# EAGLE design USB-A (EAGLE 9.3.2)
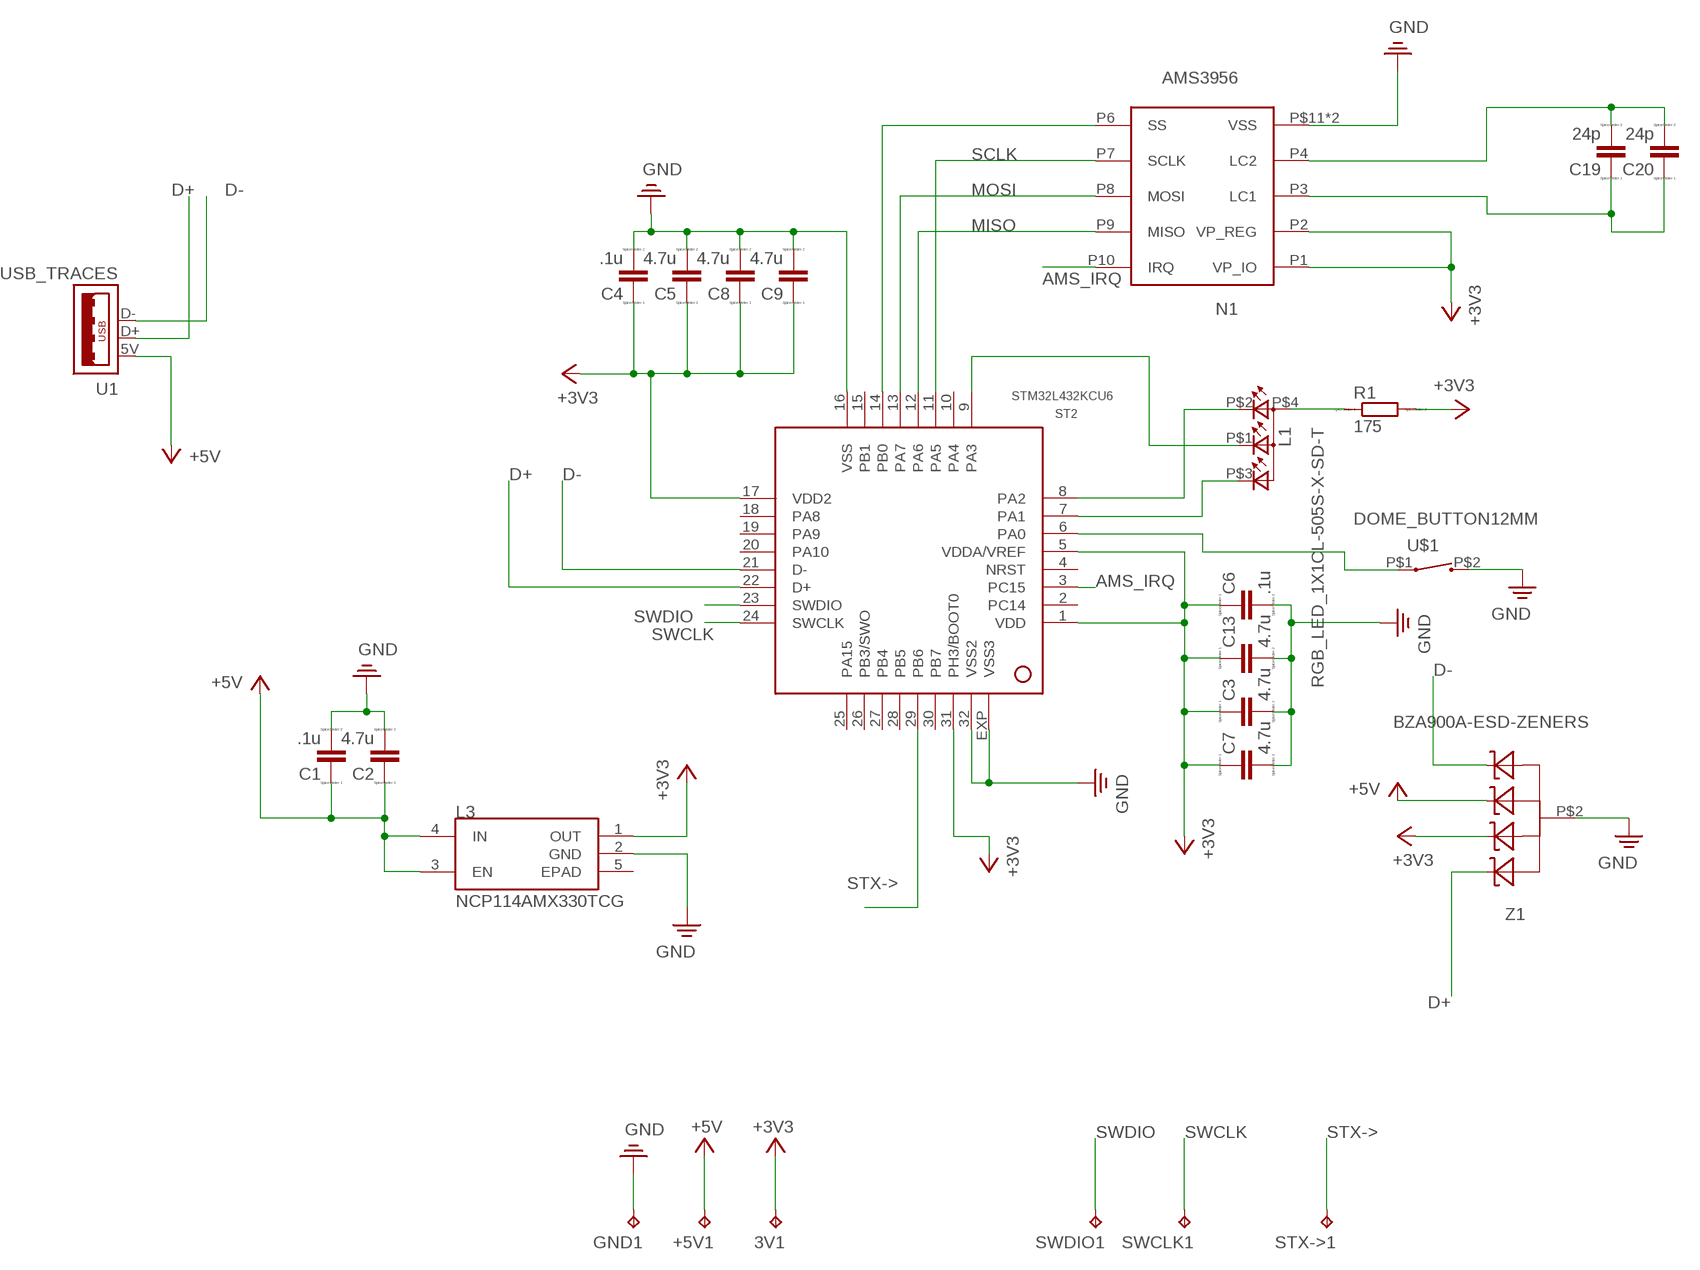
[diagram p0: schematic, sheet 1]

## Parts
3V1  TEST_POINT  [B1,27]
+5V1  TEST_POINT  [B1,27]
C1  .1u  CAPACITOR  [C0402]
C2  4.7u  CAPACITOR  [C0402]
C3  4.7u  CAPACITOR  [C0402]
C4  .1u  CAPACITOR  [C0402]
C5  4.7u  CAPACITOR  [C0402]
C6  .1u  CAPACITOR  [C0402]
C7  4.7u  CAPACITOR  [C0402]
C8  4.7u  CAPACITOR  [C0402]
C9  4.7u  CAPACITOR  [C0402]
C13  4.7u  CAPACITOR  [C0402]
C19  24p  CAPACITOR  [C0402]
C20  24p  CAPACITOR  [C0402]
GND1  TEST_POINT  [B1,27]
L1  RGB_LED_1X1CL-505S-X-SD-T  [CL-505S-X-SD-T]
L3  NCP114AMX330TCG  [REG_NCP114AMX330TCG]
N1  AMS3956  [MLPD3X3]
R1  175  RESISTOR  [R0402]
ST2  STM32L432KCU6  [QFN32]
STX->1  TEST_POINT  [B1,27]
SWCLK1  TEST_POINT  [B1,27]
SWDIO1  TEST_POINT  [B1,27]
U1  USB_TRACES  [USB_TRACES]
U$1  DOME_BUTTON12MM  [DOME-BL-12MM]
Z1  BZA900A-ESD-ZENERS  [BZA900A]

## Nets
+3V3: 3V1.TP C3.1 C4.1 C5.1 C6.1 C7.1 C8.1 C9.1 C13.1 L3.1(OUT) N1.P1(VP_IO) N1.P2(VP_REG) R1.2 ST2.1(VDD) ST2.5(VDDA/VREF) ST2.17(VDD2) ST2.31(PH3/BOOT0) Z1.P$5(C1)
+5V: +5V1.TP C1.1 C2.1 L3.3(EN) L3.4(IN) U1.5V Z1.P$1(C)
AMS_CS2: N1.P6(SS) ST2.14(PB0)
AMS_IRQ: N1.P10(IRQ) ST2.3(PC15)
D+: ST2.22(D+) U1.D+ Z1.P$3(C3)
D-: ST2.21(D-) U1.D- Z1.P$4(C2)
MISO: N1.P9(MISO) ST2.12(PA6)
MOSI: N1.P8(MOSI) ST2.13(PA7)
N$1: L1.P$4(A2) R1.1
N$10: L1.P$2(CRED) ST2.8(PA2)
N$13: L1.P$1(CBLUE) ST2.9(PA3)
N$14: L1.P$3(CGREEN) ST2.7(PA1)
N$15: ST2.6(PA0) U$1.P$1
N$16: C19.2 C20.2 N1.P4(LC2)
N$17: C19.1 C20.1 N1.P3(LC1)
PE: C1.2 C2.2 C3.2 C4.2 C5.2 C6.2 C7.2 C8.2 C9.2 C13.2 GND1.TP L3.2(GND) N1.P5(VSS) N1.P$11(VSS) ST2.16(VSS) ST2.32(VSS2) ST2.EXP(VSS3) U$1.P$2 Z1.P$2 ; supply symbol labelled GND
SCLK: N1.P7(SCLK) ST2.11(PA5)
STX->: ST2.29(PB6) STX->1.TP
SWCLK: ST2.24(SWCLK) SWCLK1.TP
SWDIO: ST2.23(SWDIO) SWDIO1.TP
Unconnected: L3.5(EPAD) ST2.2(PC14) ST2.4(NRST) ST2.10(PA4) ST2.15(PB1) ST2.18(PA8) ST2.19(PA9) ST2.20(PA10) ST2.25(PA15) ST2.26(PB3/SWO) ST2.27(PB4) ST2.28(PB5) ST2.30(PB7)

## Library data of the parts
3V1 +5V1 GND1 STX->1 SWCLK1 SWDIO1 = efm-fido:TEST_POINT
C1-C9 C13 C19 C20 = efm-fido:CAPACITOR
L1 = efm-fido:RGB_LED_1X1: EAST1616RGBA3
L3 = efm-fido:NCP114AMX330TCG: CMOS Low Dropout Regulator, 300 mA 3.3V, Active Discharge; AVAILABILITY: Unavailable; DESCRIPTION: CMOS Low Dropout Regulator _LDO_, 300 mA 3.3V, Active Discharge; MF: ON Semiconductor; MP: NCP114AMX330TCG; PACKAGE: UDFN-4 ON Semiconductor; PRICE: None
N1 = efm-fido:AMS3956
R1 = efm-fido:RESISTOR
ST2 = efm-fido:STM32L432KCU6
U1 = efm-fido:USB_TRACES
U$1 = efm-fido:DOME_BUTTON
Z1 = efm-fido:BZA900A-ESD-ZENERS

## Net classes
0 default: width 0.152 mm, drill 0.203 mm, clearance 0.102 mm
1 nfc: width 0.089 mm, drill 0.203 mm, clearance 0.089 mm

## Board
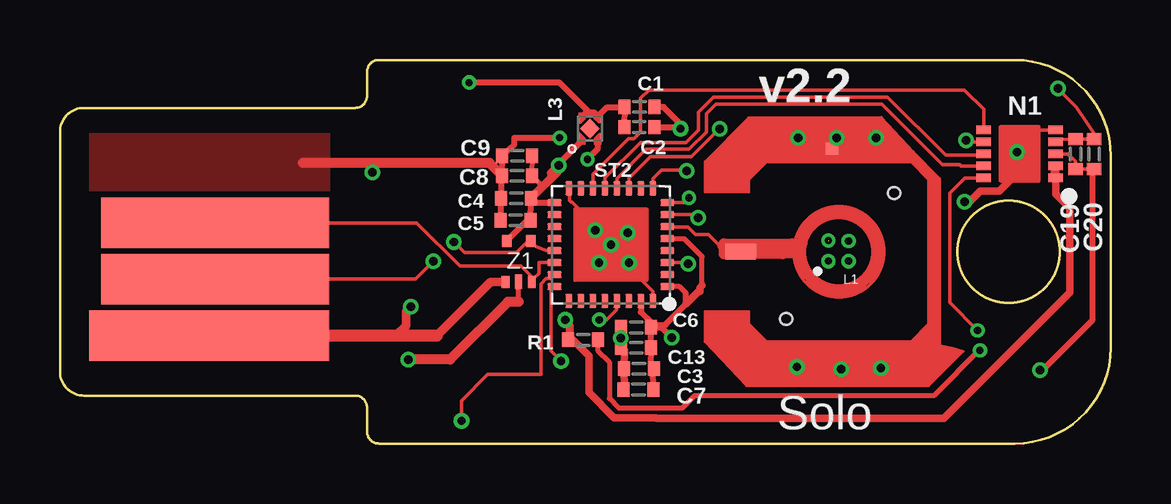
[diagram p1: board, top side]
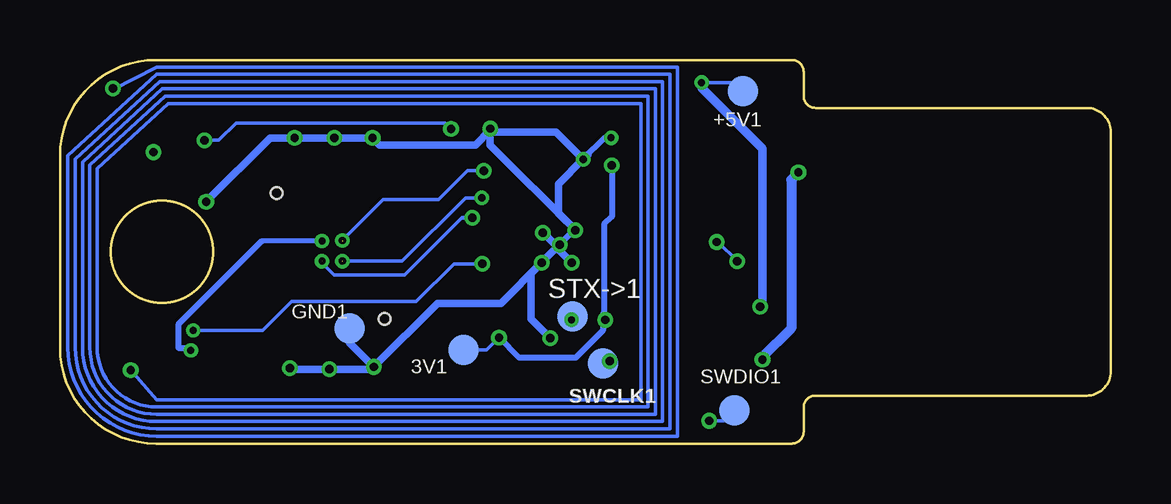
[diagram p2: board, bottom side, seen from below]

Size 43.8 x 16 mm. Coordinates in mm from the lower left corner, seen from the top.
Outline: 0,3 0,13 arc-90 1,14 12.3,14 arc90 12.8,14.5 12.8,15.5 arc-90 13.3,16 39.8,16 arc-90 43.8,12 43.8,4 arc-90 39.8,0 13.3,0 arc-90 12.8,0.5 12.8,1.5 arc90 12.3,2 1,2 arc-90 0,3
Outline: circle at 39.55,8 radius 2.12
Copper layers (1*16): Top 0.035mm / dielectric 2.35mm / Bottom 0.035mm
Design rules "default *": minimum track width 4mil, minimum drill 0.2mm, track to track 4mil, track to pad 4mil, pad to pad 4mil, via to via 5mil, smd to smd 4mil, copper to edge 8mil, drill to drill 6mil, minimum pad ring 10mil, minimum via ring 0.15mm, stop-mask expansion 4mil, vias tented up to drill 0mil, thermal gap 10mil
Holes 0.5 mm at 34.77,10.45 30.27,5.2
tRestrict: area 1.1,10.1 to 1.9,10.3

### Footprints (pad centres in the part's own frame; a part is rotated, then mirrored left to right if it is on the bottom)
B1,27 = smd 1.27 x 1.27: TP 0,0
C0402 = smd 0.5 x 0.6: 1 -0.625,0; 2 0.625,0
CL-505S-X-SD-T = smd 0.4 x 0.4: P$1 0.85,0; P$2 0.85,0.85; P$3 0,0.85; P$4 0,0
REG_NCP114AMX330TCG = smd 0.1 x 0.1: 1 -0.325,-0.5; 2 0.325,-0.5; 3 0.325,0.5; 4 -0.325,0.5 | smd 0.58 x 0.58 rotated 45: 5 0,0
MLPD3X3 = smd 0.6 x 0.35: P1 0,-0.54; P2 0,-1.04; P3 0,-1.54; P4 0,-2.04; P5 0,-2.54; P6 3,-2.54; P7 3,-2.04; P8 3,-1.54; P9 3,-1.04; P10 3,-0.54 | smd 0.2 x 0.2: P$11 1.6,-1.64
R0402 = smd 0.5 x 0.6: 1 -0.625,0; 2 0.625,0
QFN32 = smd 0.6 x 0.3: 1 -2.35,1.75; 2 -2.35,1.25; 3 -2.35,0.75; 4 -2.35,0.25; 5 -2.35,-0.25; 6 -2.35,-0.75; 7 -2.35,-1.25; 8 -2.35,-1.75; 17 2.35,-1.75; 18 2.35,-1.25; 19 2.35,-0.75; 20 2.35,-0.25; 21 2.35,0.25; 22 2.35,0.75; 23 2.35,1.25; 24 2.35,1.75 | smd 0.3 x 0.6: 9 -1.75,-2.35; 10 -1.25,-2.35; 11 -0.75,-2.35; 12 -0.25,-2.35; 13 0.25,-2.35; 14 0.75,-2.35; 15 1.25,-2.35; 16 1.75,-2.35; 25 1.75,2.35; 26 1.25,2.35; 27 0.75,2.35; 28 0.25,2.35; 29 -0.25,2.35; 30 -0.75,2.35; 31 -1.25,2.35; 32 -1.75,2.35 | smd 0.2 x 0.2: EXP 0,0
USB_TRACES = smd 10 x 2.1: 5V 0.9,3.55 | smd 9.5 x 2.1: D+ 0.65,-1.15; D- 0.65,1.2
DOME-BL-12MM = smd 1.27 x 0.635: P$1 -4.1,0 | smd 0.5 x 0.5: P$2 -0.3,4.3
BZA900A = smd 0.325 x 0.5: P$1 -0.05,0; P$3 1.05,0 | smd 0.3 x 0.6: P$2 0.5,0 | smd 0.4 x 0.5: P$4 1,1.7; P$5 0,1.7

### Placement (x,y rotation side)
3V1  26.98,3.9 0 bottom
+5V1  15.34,14.71 0 bottom
C1  24.16,14.04 0 top
C2  24.15,13.2 0 top
C3  24.14,3.13 180 top
C4  19.02,10.23 180 top
C5  19,9.31 180 top
C6  24.02,4.85 180 top
C7  24.12,2.26 180 top
C8  19.05,11.17 180 top
C9  19.06,12 180 top
C13  24.02,4 180 top
C19  .5p  [C0402]  42.34,12.08 90 top
C20  .5p  [C0402]  43.11,12.08 90 top
GND1  31.72,4.8 0 bottom
L1  32.88,8.46 180 top
L3  22.09,13.14 0 top
N1  41.5,10.54 180 top
R1  21.81,4.33 180 top
ST2  22.97,8.3 180 top
STX->1  22.43,5.31 0 bottom
SWCLK1  21.17,3.35 0 bottom
SWDIO1  15.68,1.39 0 bottom
U1  7.12,8.06 180 top
U$1  32.47,8 0 top
Z1  18.62,6.75 0 top

### Tracks (layer width: path | path; a pad name or v marks a point on that pad's centre or on a via)
+3V3  (via drill 0.35)
  Top 0.152: ST2.31 24.15,5.93 | 24.67,5.02 24.76,4.94 | C6.1 24.67,4.85 24.77,4.95 | N1.P2 41.48,11.58 41.46,11.6
  Top 0.2: C9.1 19.66,11.18 C8.1 20.07,10.75
  Top 0.203: 25.27,4.95 25.22,4.95 | 26.09,6.27 25.82,6.55 ST2.1 | ST2.5 26.02,8.55 26.77,7.8 26.77,6.6
  Top 0.254: 21.06,4.23 R1.2 21.21,4.84 21.27,4.9 21.27,4.96 v21.07,5.16 | C5.1 19.64,10.12 C4.1 | C4.1 19.86,10.05 ST2.17 | C4.1 19.7,10.23 | C4.1 19.7,10.23 20.8,11.33 v20.8,11.6 | 19.62,9.22 C5.1 | C4.1 19.62,10.3 20.07,10.75 20.42,11.1 20.42,11.29 L3.1 | 26.09,6.27 26.09,5.82 25.22,4.95 24.77,4.95 | 24.76,4.94 24.72,4.9 C6.1 | C6.1 25.07,4.85 v25.5,4.42 | C6.1 C13.1 24.62,3.25 C3.1 24.72,3.11 C7.1 | Z1.P$5 19.48,9.31 C5.1 | ST2.31 24.22,5.48 24.67,5.02
  Top 0.305: 26.09,5.82 26.62,6.35 26.67,6.35 26.67,6.5 26.77,6.6 | 21.27,4.9 21.27,4.44 22.05,3.66 22.05,2.13 23.1,1.08 24.85,1.08 24.87,1.06 36.85,1.06 42.09,6.3 42.09,9.83 41.5,10.41 N1.P1 N1.P2 | 41.46,11.6 41.46,11.12
  Bottom 0.152: v25.5,4.42 26.02,3.9 27.18,3.9
  Bottom 0.25: 22.3,3.58 24.66,3.58 v25.5,4.42
  Bottom 0.254: 22.3,3.58 21.17,4.72 21.17,5.16 v21.07,5.16 | 27.18,3.9 3V1.TP | v20.8,11.6 20.8,9.47 21.12,9.15 21.12,5.41
  Bottom 0.305: v21.07,5.16 21.12,5.41
+5V  (via drill 0.3, 0.35)
  Top 0.203: 23.5,14.03 C1.1
  Top 0.25: L3.4 21.96,13.84 21.96,13.91 | 22.06,13.82 22.26,13.82 22.41,13.66 L3.3 22.8,14.03 23.5,14.03 | C2.1 C1.1 | 17.69,15.06 v17.06,15.06
  Top 0.254: 22.01,13.87 21.94,13.81 | 22.06,13.82 22.01,13.87 | 22.01,13.87 21.96,13.91 20.82,15.06 17.69,15.06
  Top 0.35: 15.72,4.51 17.96,6.75 Z1.P$1 | 14.02,4.51 14.42,4.91 14.42,5.51 v14.62,5.71
  Top 0.508: U1.5V 14.02,4.51 15.72,4.51
  Bottom 0.152: 15.89,14.71 +5V1.TP 15.69,15.06 v17.06,15.06
  Bottom 0.35: v14.62,5.71 14.52,5.81 14.52,12.31 17.06,14.85 v17.06,15.06
AMS_CS2
  Top 0.152: ST2.14 22.22,11.25 23.69,12.72 23.92,12.72 24.2,13 24.2,14.4 24.55,14.75 37.71,14.75 38.5,13.95 N1.P6
AMS_IRQ  (via drill 0.3, 0.35)
  Top 0.152: v38.25,4.72 37.09,5.88 37.09,10.45 37.72,11.08 N1.P10 | v26.19,7.5 26.14,7.55 ST2.3
  Bottom 0.152: v38.25,4.72 35.35,4.72 34.14,5.93 28.95,5.93 27.38,7.5 v26.19,7.5
D+
  Top 0.152: U1.D+ 14.87,9.21 16.67,7.41 19.22,7.41 19.75,6.88 | 19.75,6.88 19.67,6.8 Z1.P$3 19.7,6.74 | 19.75,6.88 19.97,7.1 19.97,7.55 ST2.22
D-  (via drill 0.35)
  Top 0.152: U1.D- 14.82,6.86 v15.57,7.61 | ST2.21 20.26,8.05 19.84,8.22 Z1.P$4 19.52,8.45 19.03,7.96 16.86,7.96 v16.42,8.41
  Bottom 0.152: v16.42,8.41 16.37,8.41 v15.57,7.61
MISO
  Top 0.152: ST2.12 23.22,11.06 24.43,12.28 26.23,12.28 26.94,12.99 26.94,13.76 27.33,14.15 34.26,14.15 36.79,11.63 37.5,11.63 37.55,11.58 N1.P9
MOSI
  Top 0.152: N1.P8 38.46,12.04 37.38,12.04 37.38,12.03 36.92,12.03 34.5,14.46 27.25,14.46 26.61,13.82 26.61,13.07 26.1,12.56 24.19,12.56 22.72,11.09 ST2.13
N$1  (via drill 0.3)
  Top 0.152: L1.P$4 v32.88,8.45
  Top 0.2: R1.1 22.41,3.89 22.9,3.4 22.9,1.88 23.29,1.49 25.95,1.49 26.46,2.01
  Top 0.203: 38.28,4.07 38.35,4 v38.35,3.89 38.33,3.9 36.44,2.01 26.46,2.01
  Bottom 0.152: v32.88,8.45 v32.87,8.45
  Bottom 0.2: v32.87,8.45 35.39,8.45
  Bottom 0.254: v38.35,3.89 38.35,4 38.87,4 38.87,4.97 35.39,8.45
N$2
  Bottom 0.152: 41.6,14.76 39.77,15.71 18.07,15.71 18.07,0.31 39.77,0.31 arc90 43.47,4.01 43.47,12.01 39.77,15.4 18.37,15.4 18.37,0.61 39.77,0.61 arc90 43.16,4.01 43.16,11.87 39.65,15.1 18.68,15.1 18.68,0.92 39.77,0.92 arc90 42.86,4.01 42.86,11.74 39.53,14.79 18.98,14.79 18.98,1.22 39.77,1.22 arc90 42.55,4.01 42.55,11.61 39.41,14.49 19.29,14.49 19.29,1.53 39.77,1.53 arc90 42.25,4.01 42.25,11.47 39.29,14.18 19.59,14.18 19.59,1.83 39.77,1.83 40.87,3.09
N$10  (via drill 0.3)  (1 unrouted)
  Top 0.152: ST2.8 26.02,10.05 v26.22,10.25
  Bottom 0.152: L1.P$2 29.53,7.61 26.9,10.25 v26.22,10.25
  other vias: 32.03,7.61
N$13  (via drill 0.3, 0.35)  (1 unrouted)
  Top 0.152: v26.13,11.38 26.13,11.4 25.07,11.4 24.72,11.05 ST2.9
  Bottom 0.152: v26.13,11.38 26.81,11.38 28.02,10.17 30.33,10.17 v32.03,8.47
N$14  (via drill 0.3, 0.35)  (1 unrouted)
  Top 0.152: ST2.7 26.36,9.55 | 26.36,9.55 26.43,9.48 | 26.43,9.48 26.54,9.37 | 26.43,9.48 26.55,9.48 v26.61,9.42 26.48,9.55 26.36,9.55
  Bottom 0.152: L1.P$3 32.88,7.54 32.38,7.04 29.43,7.04 27.06,9.4 | 27.06,9.4 26.93,9.4 | 27.06,9.4 27.05,9.42 v26.61,9.42
  other vias: 32.88,7.61
N$15
  Top 0.152: ST2.6 25.29,9.03 26.19,9.03 26.49,8.72 27.04,8.72 27.51,8.24 28.38,8.24 | 27.67,7.95 27.69,7.97 27.74,7.97 27.79,7.97 27.76,8 | U$1.P$1 27.76,8 | 27.76,8 27.74,8.02
  Top 0.254: 27.51,8.24 27.74,8.02 27.74,7.97
N$16  (via drill 0.35)
  Top 0.152: 41.53,12.58 N1.P4 41.6,12.68 C19.2 | C19.2 43.28,12.68 42.37,14.03 v41.6,14.81 | 42.48,12.53 C19.2 | C20.2 C19.2
N$17  (via drill 0.35)
  Top 0.152: N1.P3 42.01,12.08 42.32,11.78 42.32,11.5 C19.1 C20.1 43.03,11.39
  Top 0.25: 43.03,11.39 43.03,5.13 41.01,3.11 40.9,3.11 v40.85,3.06
PE  (via drill 0.3, 0.35)
  Top 0.152: ST2.32 24.72,6.35 23.27,7.8 23.27,8 | ST2.16 21.24,10.58 21.24,10.13 21.3,10.07 21.35,10.07 22.97,8.45 ST2.EXP | C13.2 v23.37,4.4 | N1.P5 40.47,13.08 40.47,12.66 40.13,12.32 | v37.71,10.09 | 39.87,12.06 39.95,12.14 | 39.95,12.14 39.97,12.16 | 39.95,12.14 N1.P$11 40.05,12.32 40.13,12.32 | 40.13,12.32 39.97,12.16 | 39.97,12.16 v39.9,12.16
  Top 0.203: 19.12,5.91 Z1.P$2
  Top 0.25: C1.2 25.16,14.04 25.86,13.33 v25.86,13.14 25.8,13.2 C2.2 | v20.83,12.76 18.94,12.76 18.94,12.48 C9.2 18.45,11.99 C8.2 18.42,11.14 C4.2 18.4,10.21 C5.2 | L3.2 22.41,12.28 v21.99,11.86
  Top 0.254: v22.32,8.9 22.37,8.9 ST2.EXP 23.27,8 v23.72,7.55 | v23.67,8.8 22.47,8.8 v22.47,7.55 | v23.37,4.4 C6.2 | v21.99,11.86 21.85,12 | L3.2 22.48,12.64
  Top 0.305: U$1.P$2 32.37,12.5 v32.37,12.75 | v37.71,10.09 37.93,10.09 38.37,10.53 39.15,10.53 40.28,11.66 39.87,12.06 | N1.P$11 40.08,12.18 | C7.2 23.54,2.28 C3.2 23.54,3.88 C13.2
  Top 0.406: C8.2 17.91,11.71 13.02,11.71 | 13.02,11.71 10.12,11.71 | v14.52,3.51 16.27,3.51 18.67,5.91 19.12,5.91 | v13.02,11.31 13.02,11.71
  Bottom 0.254: 23.07,8.3 ST2.EXP 22.37,8.9 v22.32,8.9 | v21.99,11.86 21.09,12.76 v20.83,12.76
  Bottom 0.305: 21.79,12.06 v21.99,11.86 | v21.99,11.86 23.12,12.99 25.71,12.99 v25.86,13.14 | v25.86,13.14 25.86,13.07 26.48,12.45 30.47,12.45 v30.77,12.75 v32.37,12.75 v34.02,12.75 35.05,12.75 v37.71,10.09 | v34.22,3.15 34.17,3.1 v32.57,3.1 30.82,3.1 v30.72,3.2 | v30.72,3.2 31.72,4.2 GND1.TP | v23.37,4.4 24.17,5.2 24.17,7.1 v23.72,7.55 | v23.72,7.55 ST2.EXP 22.97,8.05 v22.47,7.55 | v23.67,8.8 23.17,8.3 23.07,8.3 | v23.72,7.55 25.42,5.85 28.07,5.85 v30.72,3.2 | v25.86,13.14 25.86,12.44 v22.32,8.9 23.02,9.6 23.02,10.83 v21.99,11.86
  Bottom 0.406: v13.02,11.31 13.32,11.01 13.32,4.81 14.52,3.61 v14.52,3.51
  other vias: 22.97,8.3
  pour Top (isolate 0.254): 1.27,10.51 1.27,12.91 11.23,12.91 11.23,10.51
SCLK  (via drill 0.35)
  Top 0.152: 38.44,12.64 N1.P7 37.95,12.58 37.88,12.65 v37.77,12.65 | ST2.11 23.72,11.07 24.61,11.96 26.33,11.96 v27.5,13.13
  Bottom 0.152: v37.77,12.65 37.18,12.65 36.47,13.37 27.75,13.37 v27.51,13.13 v27.5,13.13
STX->  (via drill 0.3)
  Top 0.152: ST2.29 23.2,5.93 23.2,5.58 22.78,5.16 v22.48,5.16 22.37,5.06
  Bottom 0.152: STX->1.TP v22.48,5.16
SWCLK  (via drill 0.35)
  Top 0.152: v20.88,3.44 20.46,3.86 20.46,6.39 ST2.24
  Bottom 0.152: v20.88,3.44 20.83,3.49
  Bottom 0.254: v20.88,3.44 20.97,3.35 SWCLK1.TP
SWDIO  (via drill 0.35)
  Top 0.152: ST2.23 20.45,6.88 20.27,6.88 20.06,6.66 20.06,2.88 17.83,2.88 16.74,1.79 v16.74,0.95
  Bottom 0.152: v16.74,0.95 16.12,0.95 SWDIO1.TP

### Text on the board
tPlace: v2.2 | Solo